# EAGLE design contbrd (EAGLE 9.4.0)

## Sheet 1 of 3: Microcontrollers The STM and ESP
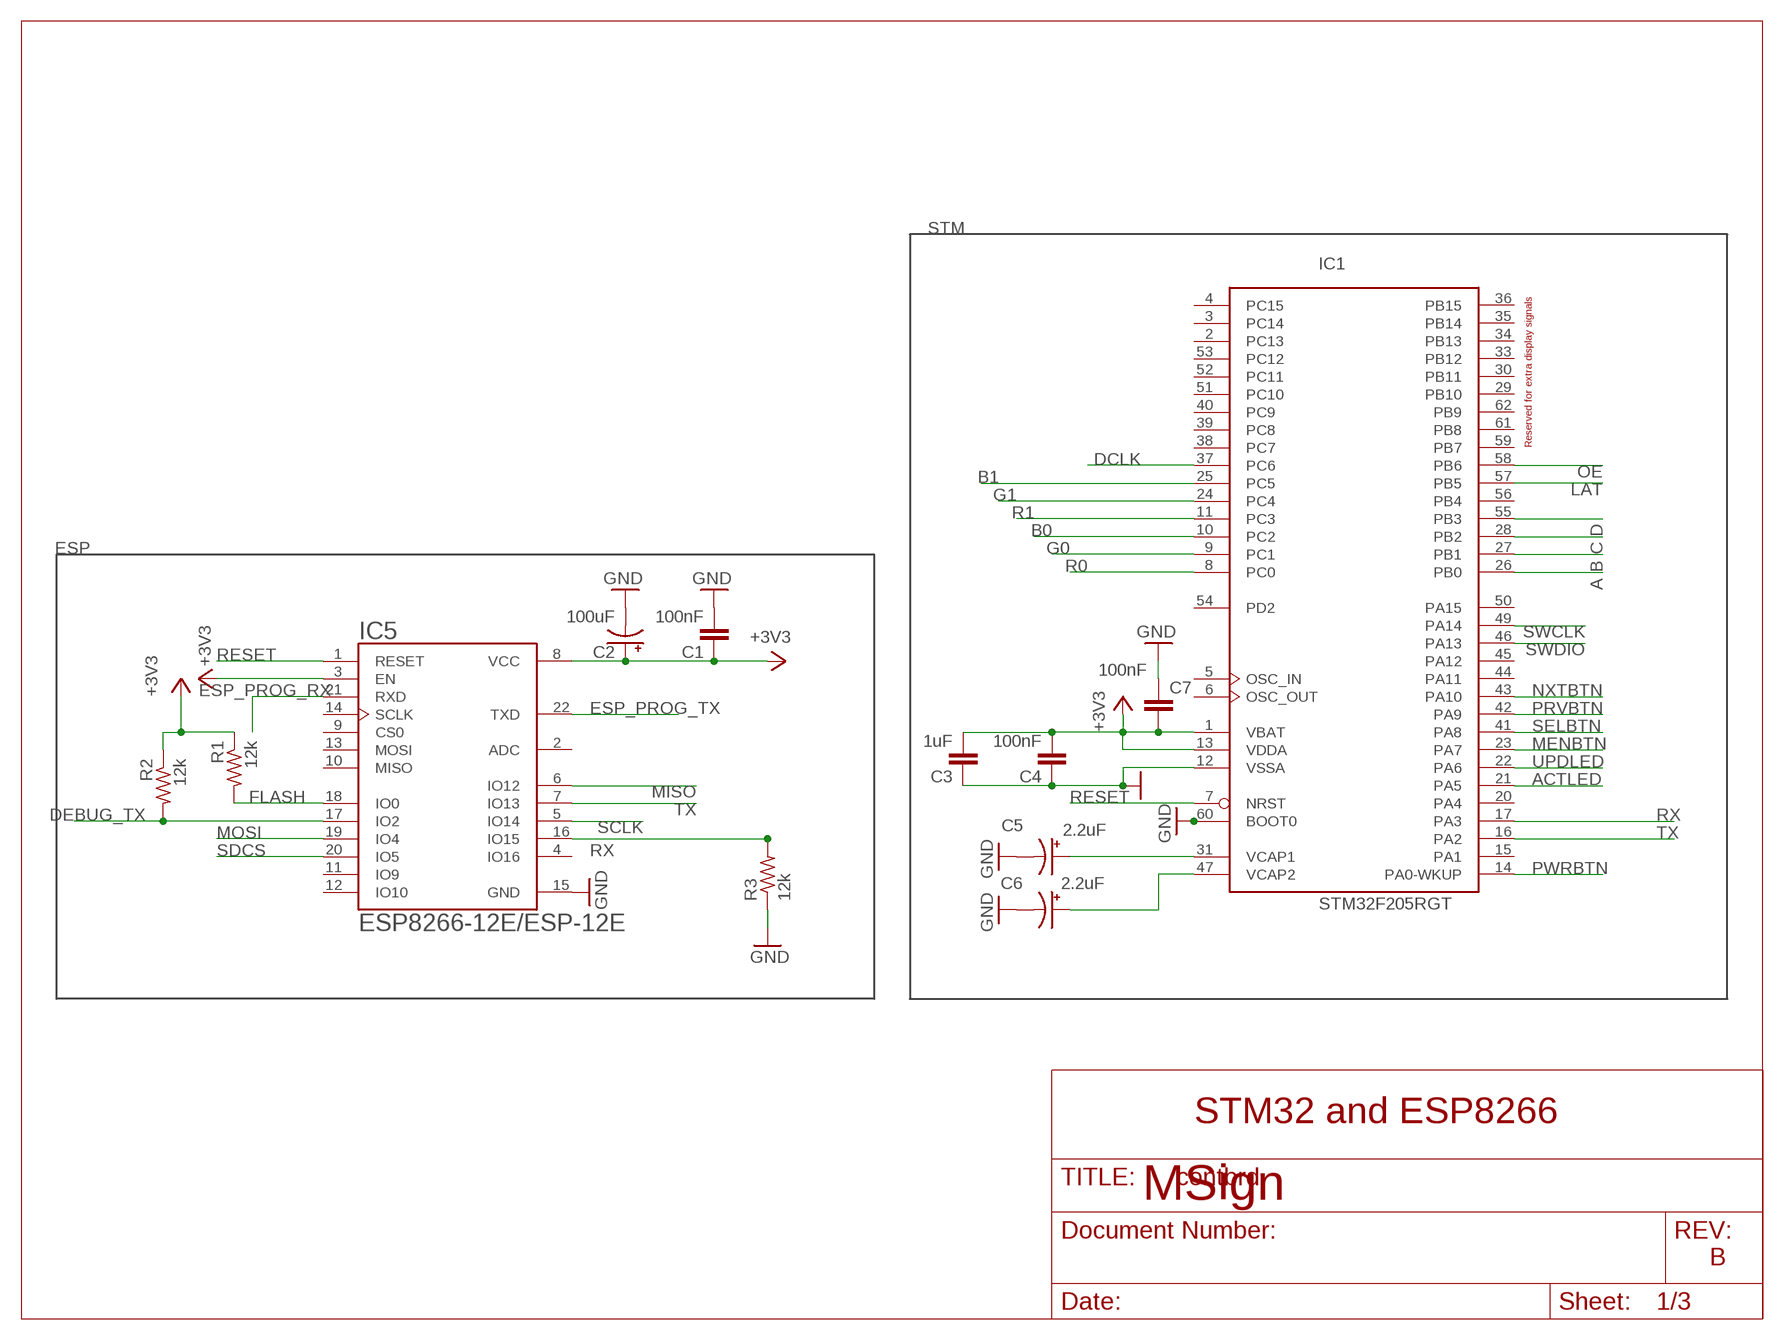
[diagram p0: schematic, sheet 1]

### Parts
C1  100nF  C-EU025-025X050  [C025-025X050]
C2  100uF  CPOL-USE2.5-6  [E2,5-6]
C3  1uF  C-EU050-024X044  [C050-024X044]
C4  100nF  C-EU025-025X050  [C025-025X050]
C5  2.2uF  CPOL-USE1.8-4  [E1,8-4]
C6  2.2uF  CPOL-USE1.8-4  [E1,8-4]
C7  100nF  C-EU025-025X050  [C025-025X050]
IC1  STM32F205RGT  [LQFP64]
IC5  ESP8266-12E/ESP-12E  [XCVR_ESP8266-12E/ESP-12E]
R1  12k  R-US_0204/7  [0204/7]
R2  12k  R-US_0204/7  [0204/7]
R3  12k  R-US_0204/7  [0204/7]

### Nets
+3V3: C1.1 C2.+ C3.2 C4.2 C7.2 IC1.1(VBAT) IC1.13(VDDA) IC5.3(EN) IC5.8(VCC) R1.1 R2.1 ; also sheet 2,3
A: IC1.26(PB0) ; also sheet 3
ACTLED: IC1.21(PA5) ; also sheet 3
B: IC1.27(PB1) ; also sheet 3
B0: IC1.10(PC2) ; also sheet 3
B1: IC1.25(PC5) ; also sheet 3
C: IC1.28(PB2) ; also sheet 3
D: IC1.55(PB3) ; also sheet 3
DCLK: IC1.37(PC6) ; also sheet 3
DEBUG_TX: IC5.17(IO2) R2.2 ; also sheet 3
ESP_PROG_RX: IC5.21(RXD) ; also sheet 3
ESP_PROG_TX: IC5.22(TXD) ; also sheet 3
FLASH: IC5.18(IO0) R1.2 ; also sheet 2
G0: IC1.9(PC1) ; also sheet 3
G1: IC1.24(PC4) ; also sheet 3
GND: C1.2 C2.- C3.1 C4.1 C5.- C6.- C7.1 IC1.12(VSSA) IC1.60(BOOT0) IC5.15(GND) R3.1 ; also sheet 2,3
LAT: IC1.57(PB5) ; also sheet 3
MENBTN: IC1.23(PA7) ; also sheet 3
MISO: IC5.6(IO12) ; also sheet 3
MOSI: IC5.19(IO4) ; also sheet 3
N$2: C5.+ IC1.31(VCAP1)
N$3: C6.+ IC1.47(VCAP2)
NXTBTN: IC1.43(PA10) ; also sheet 3
OE: IC1.58(PB6) ; also sheet 3
PRVBTN: IC1.42(PA9) ; also sheet 3
PWRBTN: IC1.14(PA0-WKUP) ; also sheet 3
R0: IC1.8(PC0) ; also sheet 3
R1: IC1.11(PC3) ; also sheet 3
RESET: IC1.7(NRST) IC5.1(RESET) ; also sheet 2,3
RX: IC1.17(PA3) IC5.16(IO15) R3.2
SCLK: IC5.5(IO14) ; also sheet 3
SDCS: IC5.20(IO5) ; also sheet 3
SELBTN: IC1.41(PA8) ; also sheet 3
SWCLK: IC1.49(PA14) ; also sheet 3
SWDIO: IC1.46(PA13) ; also sheet 3
TX: IC1.16(PA2) IC5.7(IO13)
UPDLED: IC1.22(PA6) ; also sheet 3
Unconnected: IC1.2(PC13) IC1.3(PC14) IC1.4(PC15) IC1.5(OSC_IN) IC1.6(OSC_OUT) IC1.15(PA1) IC1.20(PA4) IC1.29(PB10) IC1.30(PB11) IC1.33(PB12) IC1.34(PB13) IC1.35(PB14) IC1.36(PB15) IC1.38(PC7) IC1.39(PC8) IC1.40(PC9) IC1.44(PA11) IC1.45(PA12) IC1.50(PA15) IC1.51(PC10) IC1.52(PC11) IC1.53(PC12) IC1.54(PD2) IC1.56(PB4) IC1.59(PB7) IC1.61(PB8) IC1.62(PB9) IC5.2(ADC) IC5.4(IO16) IC5.9(CS0) IC5.10(MISO) IC5.11(IO9) IC5.12(IO10) IC5.13(MOSI) IC5.14(SCLK)

### Notes on the sheet
- STM
- Reserved for extra display signals
- ESP
- STM32 and ESP8266
- MSign
- B

## Sheet 2 of 3: Power Regulators and buttons
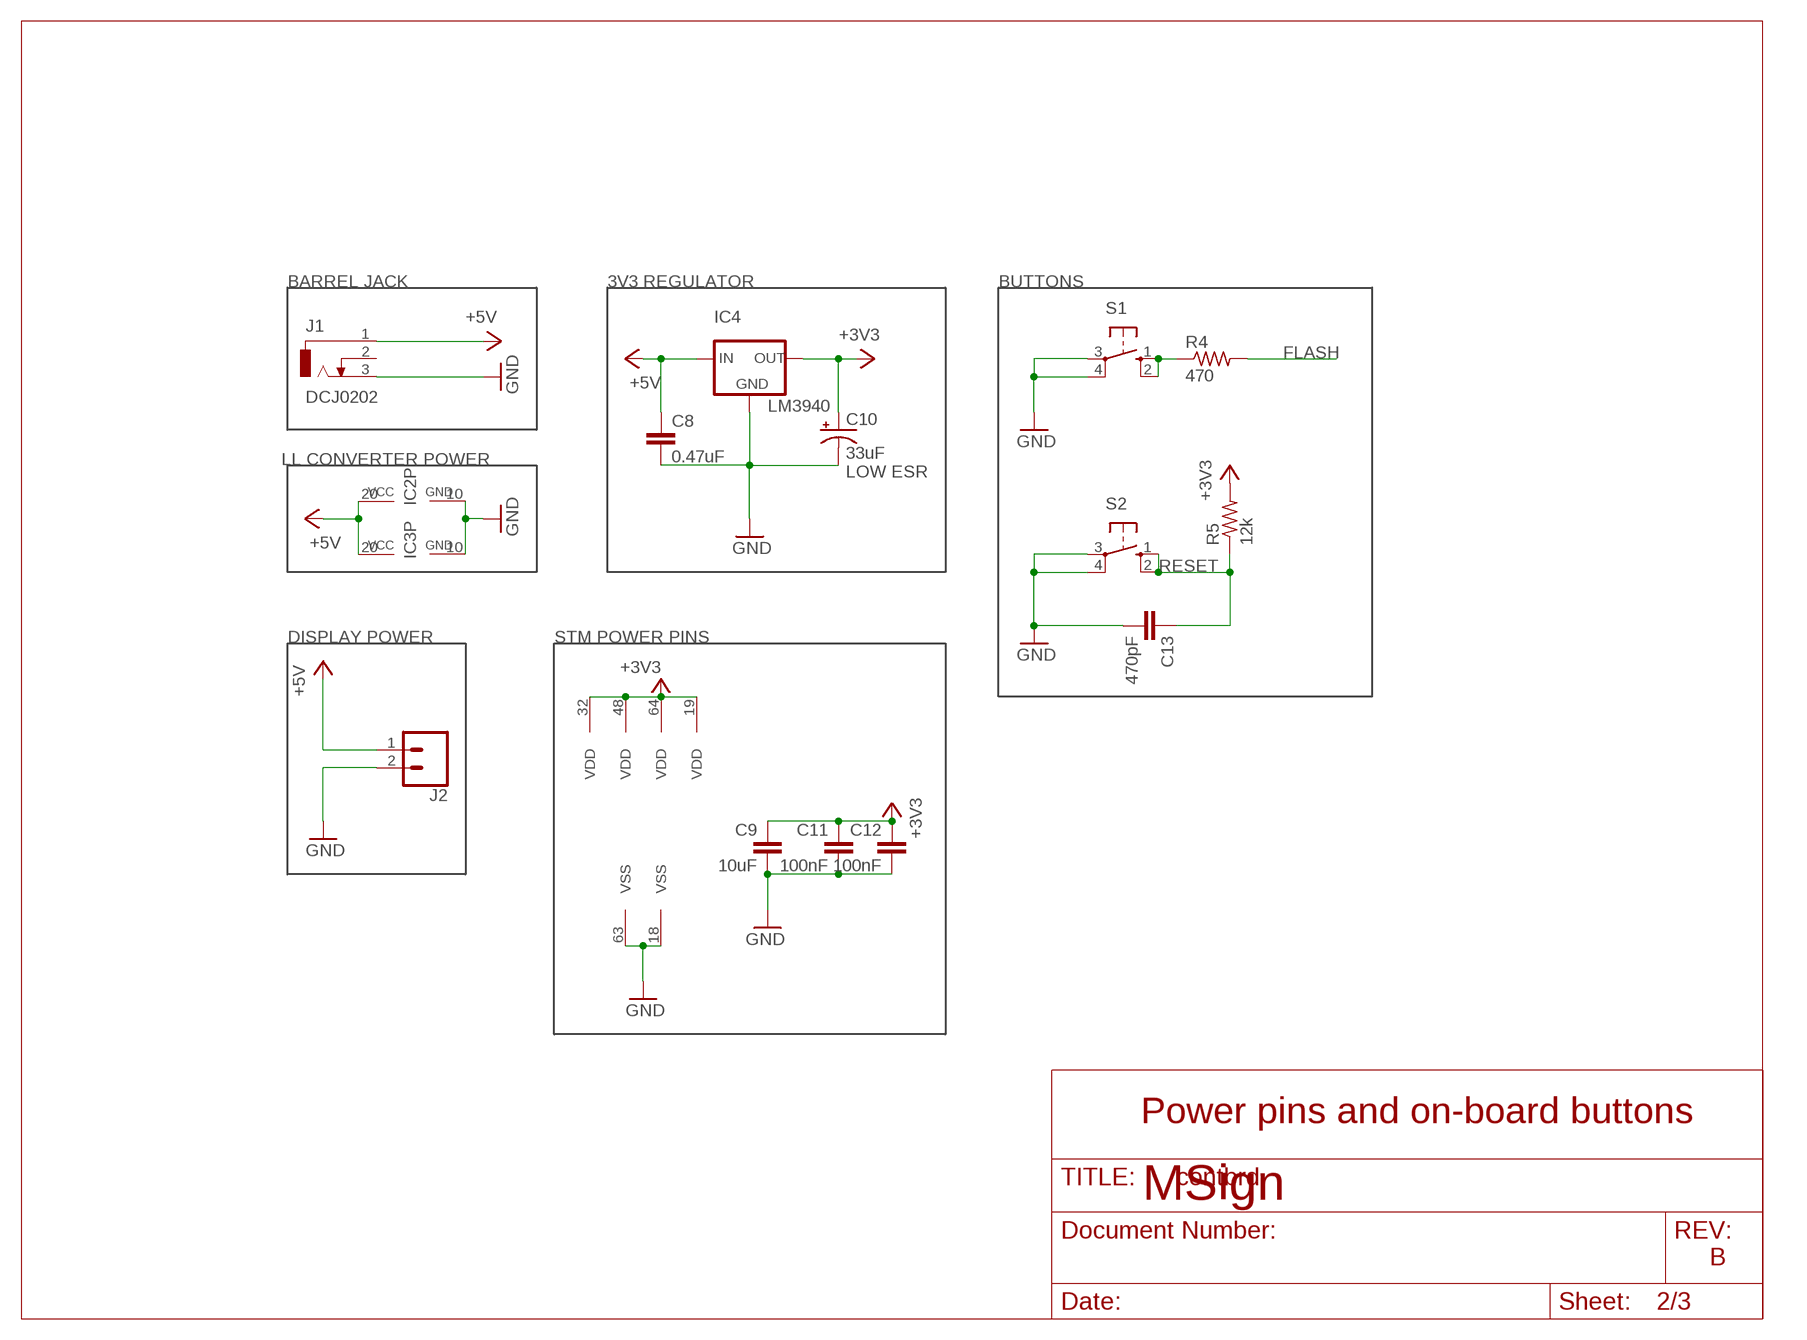
[diagram p1: schematic, sheet 2]

### Parts
C8  0.47uF  C-EU050-024X044  [C050-024X044]
C9  10uF  C-EU025-025X050  [C025-025X050]
C10  33uF  CPOL-USE2-5  [E2-5]
C11  100nF  C-EU025-025X050  [C025-025X050]
C12  100nF  C-EU025-025X050  [C025-025X050]
C13  470pF  C-EU025-025X050  [C025-025X050]
IC2  74HCT244DW  [SO20W]
IC3  74HCT244DW  [SO20W]
IC4  LM3940  [TO220]
J1  DCJ0202  [DCJ0202]
J2  CONN_025MM  [SCREWTERMINAL-5MM-2]
R4  470  R-US_0204/7  [0204/7]
R5  12k  R-US_0204/7  [0204/7]
S1  10-XX  [B3F-10XX]
S2  10-XX  [B3F-10XX]

### Nets
+3V3: C9.1 C10.+ C11.1 C12.1 IC1.19(VDD) IC1.32(VDD) IC1.48(VDD) IC1.64(VDD) IC4.3(OUT) R5.2 ; also sheet 1,3
+5V: C8.1 IC2.20(P:VCC) IC3.20(P:VCC) IC4.1(IN) J1.1 J2.1
FLASH: R4.2 ; also sheet 1
GND: C8.2 C9.2 C10.- C11.2 C12.2 C13.2 IC1.18(VSS) IC1.63(VSS) IC2.10(P:GND) IC3.10(P:GND) IC4.2(GND) J1.3 J2.2 S1.3(P) S1.4(P1) S2.3(P) S2.4(P1) ; also sheet 1,3
N$1: R4.1 S1.1(S) S1.2(S1)
RESET: C13.1 R5.1 S2.1(S) S2.2(S1) ; also sheet 1,3
Unconnected: J1.2

### Notes on the sheet
- BARREL JACK | 3V3 REGULATOR | BUTTONS
- LL CONVERTER POWER
- LOW ESR
- DISPLAY POWER | STM POWER PINS
- Power pins and on-board buttons
- MSign
- B

## Sheet 3 of 3: Connectors External board connectors + debug headers
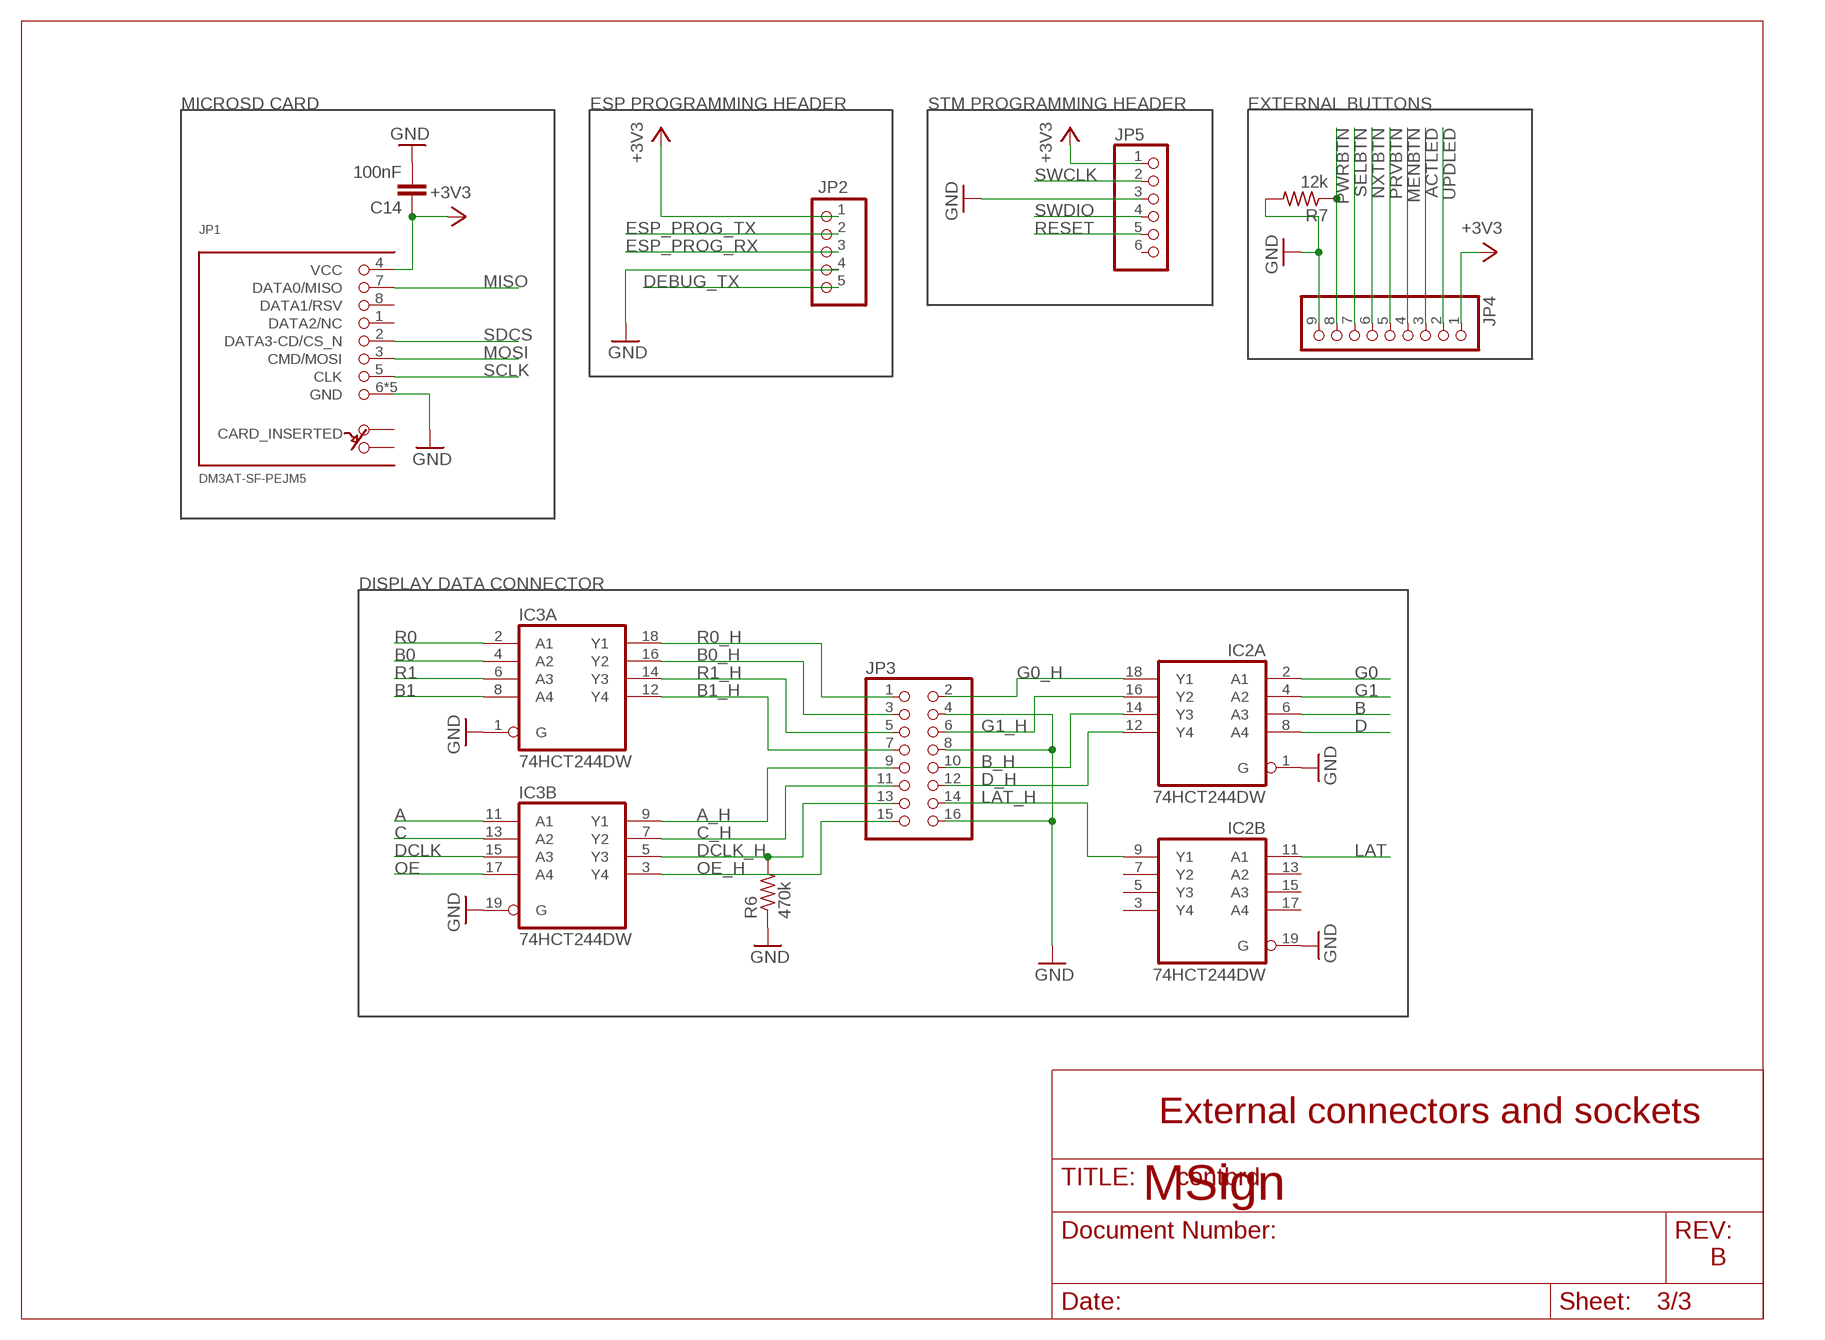
[diagram p2: schematic, sheet 3]

### Parts
C14  100nF  C-EU025-025X050  [C025-025X050]
JP1  DM3AT-SF-PEJM5  [DM3AT-SF-PEJM5]
JP2  PINHD-1X5  [1X05]
JP3  PINHD-2X8  [2X08]
JP4  PINHD-1X9  [1X09]
JP5  PINHD-1X6  [1X06]
R6  470k  R-US_0204/7  [0204/7]
R7  12k  R-US_0204/7  [0204/7]

### Nets
+3V3: C14.1 JP1.4(VCC) JP2.1 JP4.1 JP5.1 ; also sheet 1,2
A: IC3.11(B:A1) ; also sheet 1
A_H: IC3.9(B:Y1) JP3.9
ACTLED: JP4.3 ; also sheet 1
B: IC2.6(A:A3) ; also sheet 1
B0: IC3.4(A:A2) ; also sheet 1
B0_H: IC3.16(A:Y2) JP3.3
B1: IC3.8(A:A4) ; also sheet 1
B1_H: IC3.12(A:Y4) JP3.7
B_H: IC2.14(A:Y3) JP3.10
C: IC3.13(B:A2) ; also sheet 1
C_H: IC3.7(B:Y2) JP3.11
D: IC2.8(A:A4) ; also sheet 1
D_H: IC2.12(A:Y4) JP3.12
DCLK: IC3.15(B:A3) ; also sheet 1
DCLK_H: IC3.5(B:Y3) JP3.13 R6.2
DEBUG_TX: JP2.5 ; also sheet 1
ESP_PROG_RX: JP2.3 ; also sheet 1
ESP_PROG_TX: JP2.2 ; also sheet 1
G0: IC2.2(A:A1) ; also sheet 1
G0_H: IC2.18(A:Y1) JP3.2
G1: IC2.4(A:A2) ; also sheet 1
G1_H: IC2.16(A:Y2) JP3.6
GND: C14.2 IC2.1(A:G) IC2.19(B:G) IC3.1(A:G) IC3.19(B:G) JP1.6(GND) JP1.MOUNT0(GND) JP1.MOUNT1(GND) JP1.MOUNT2(GND) JP1.MOUNT3(GND) JP2.4 JP3.4 JP3.8 JP3.16 JP4.9 JP5.3 R6.1 R7.2 ; also sheet 1,2
LAT: IC2.11(B:A1) ; also sheet 1
LAT_H: IC2.9(B:Y1) JP3.14
MENBTN: JP4.4 ; also sheet 1
MISO: JP1.7(DATA0/MISO) ; also sheet 1
MOSI: JP1.3(CMD/MOSI) ; also sheet 1
NXTBTN: JP4.6 ; also sheet 1
OE: IC3.17(B:A4) ; also sheet 1
OE_H: IC3.3(B:Y4) JP3.15
PRVBTN: JP4.5 ; also sheet 1
PWRBTN: JP4.8 R7.1 ; also sheet 1
R0: IC3.2(A:A1) ; also sheet 1
R0_H: IC3.18(A:Y1) JP3.1
R1: IC3.6(A:A3) ; also sheet 1
R1_H: IC3.14(A:Y3) JP3.5
RESET: JP5.5 ; also sheet 1,2
SCLK: JP1.5(CLK) ; also sheet 1
SDCS: JP1.2(DATA3-CD/CS_N) ; also sheet 1
SELBTN: JP4.7 ; also sheet 1
SWCLK: JP5.2 ; also sheet 1
SWDIO: JP5.4 ; also sheet 1
UPDLED: JP4.2 ; also sheet 1
Unconnected: IC2.3(B:Y4) IC2.5(B:Y3) IC2.7(B:Y2) IC2.13(B:A2) IC2.15(B:A3) IC2.17(B:A4) JP1.1(DATA2/NC) JP1.8(DATA1/RSV) JP1.A JP1.B JP5.6

### Notes on the sheet
- MICROSD CARD | ESP PROGRAMMING HEADER | STM PROGRAMMING HEADER | EXTERNAL BUTTONS
- DISPLAY DATA CONNECTOR
- External connectors and sockets
- MSign
- B

## Library data of the parts
C1 C3 C4 C7-C9 C11-C14 = rcl:C-EU: CAPACITOR, European symbol; SPICEPREFIX: C
C2 C5 C6 C10 = rcl:CPOL-US: POLARIZED CAPACITOR, American symbol; SPICEPREFIX: C
IC1 = micro-stm_v3:STM32F205R*T: ARM 32-bit Cortex™-M3 CPU 120 MHz maximum frequency 128 to 1024 Kbytes of Flash memory 64 to 128 kbytes of SRAM 51 GPIOs 1.8 to 3.6 V application supply
IC2 IC3 = 74xx-eu:74*244: Octal BUFFER and LINE DRIVER, 3-state
IC4 = LM3940:LM3940: LM3940 1A Low Dropout Regulator for 5V to 3.3V Conversion; AVAILABILITY: Unavailable; MF: Texas Instruments; MP: LM3940; PACKAGE: SOT-223-4 Texas Instruments; PRICE: None
IC5 = ESP8266-12E_ESP-12E:ESP8266-12E/ESP-12E: ESP-12E WiFi Module; AVAILABILITY: Unavailable; DESCRIPTION: This WiFi module has a 32-bit MCU micro and clock speeds supporting 80 MHz or 160 MHz. Supports the RTOS and integrated Wi-Fi MAC/BB/RF/PA/LNA, and has an on-board antenna.; MF: AI-Thinker; MP: ESP8266-12E/ESP-12E; PACKAGE: None; PRICE: None
J1 = con-jack:DCJ0202: DC POWER JACK Source: DCJ0202.pdf; OC_FARNELL: unknown; OC_NEWARK: unknown
J2 = SparkFun-Connectors:CONN_02: Multi connection point. Often used as Generic Header-pin footprint for 0.1 inch spaced/style header connections On any of the 0.1 inch spaced packages, you can populate with these: Break Away Headers - Straight <https://www.sparkfun.com/products/116> (PRT-00116) Break Away Male Headers - Right Angle <https://www.sparkfun.com/products/553> (PRT-00553) Female Headers <https://www.sparkfun.com/products/115> (PRT-00115) Break Away Headers - Machine Pin <https://www.sparkfun.com/products/117> (PRT-00117) Break Away Female Headers - Swiss Machine Pin <https://www.sparkfun.com/products/743> (PRT-00743) For SCREWTERMINALS and SPRING TERMINALS visit here: Screw Terimnals on SparkFun.com <https://www.sparkfun.com/search/results?term=Screw+Terminals> (5mm/3.5mm/2.54mm spacing) This device is also useful as a general connection point to wire up your design to another part of your project. Our various solder wires solder well into these plated through hole pads. Hook-Up Wire - Assortment (Stranded, 22 AWG) <https://www.sparkfun.com/products/11375> (PRT-11375) Hook-Up Wire - Assortment (Solid Core, 22 AWG) <https://www.sparkfun.com/products/11367> (PRT-11367) View the entire wire category on our website here <https://www.sparkfun.com/categories/141> Special notes: Molex polarized connector foot print use with: PRT-08233 with associated crimp pins and housings. 2.54_SCREWTERM for use with PRT-10571. 3.5mm Screw Terminal footprints for PRT-08084 5mm Screw Terminal footprints for use with PRT-08432; SF_SKU: PRT-08432
JP1 = connector:DM3AT-SF-PEJM5: CONN MICRO SD R/A PUSH-PUSH SMD; DESCRIPTION: CONN MICRO SD CARD PUSH-PUSH R/A; DIGIKEY: HR1964CT-ND; MANUFACTURER: Hirose Electric Co Ltd; MPN: DM3AT-SF-PEJM5
JP2 = pinhead:PINHD-1X5: PIN HEADER
JP3 = pinhead:PINHD-2X8: PIN HEADER
JP4 = pinhead:PINHD-1X9: PIN HEADER
JP5 = pinhead:PINHD-1X6: PIN HEADER
R1-R7 = rcl:R-US_: RESISTOR, American symbol; SPICEPREFIX: R
S1 S2 = switch-omron:10-XX: OMRON SWITCH; MPN: B3F-1000; OC_FARNELL: 176432; OC_NEWARK: 36M3542

## Board
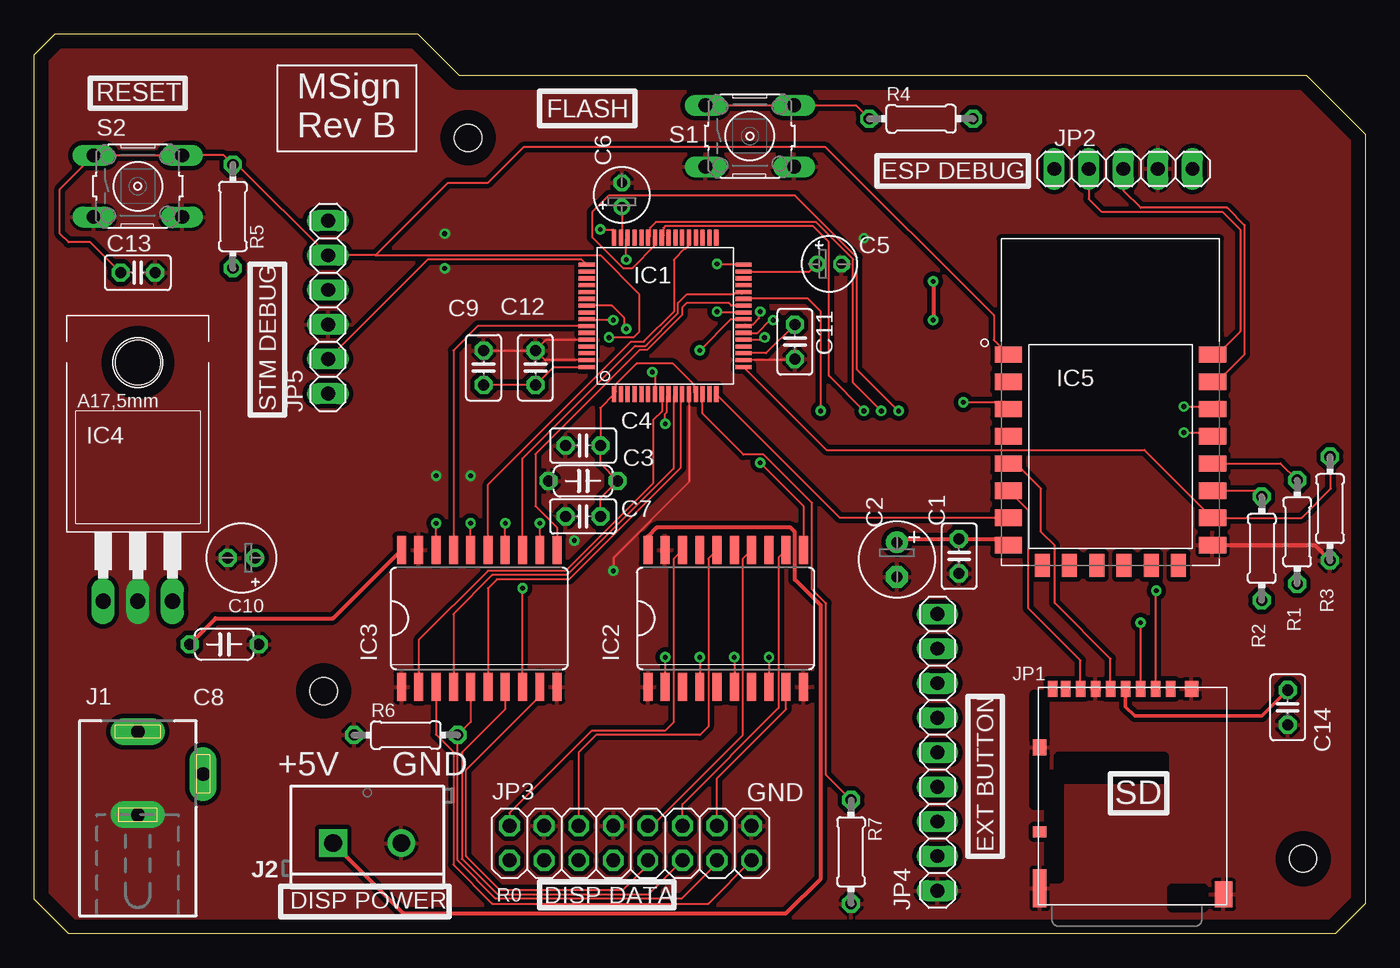
[diagram p3: board, top side]
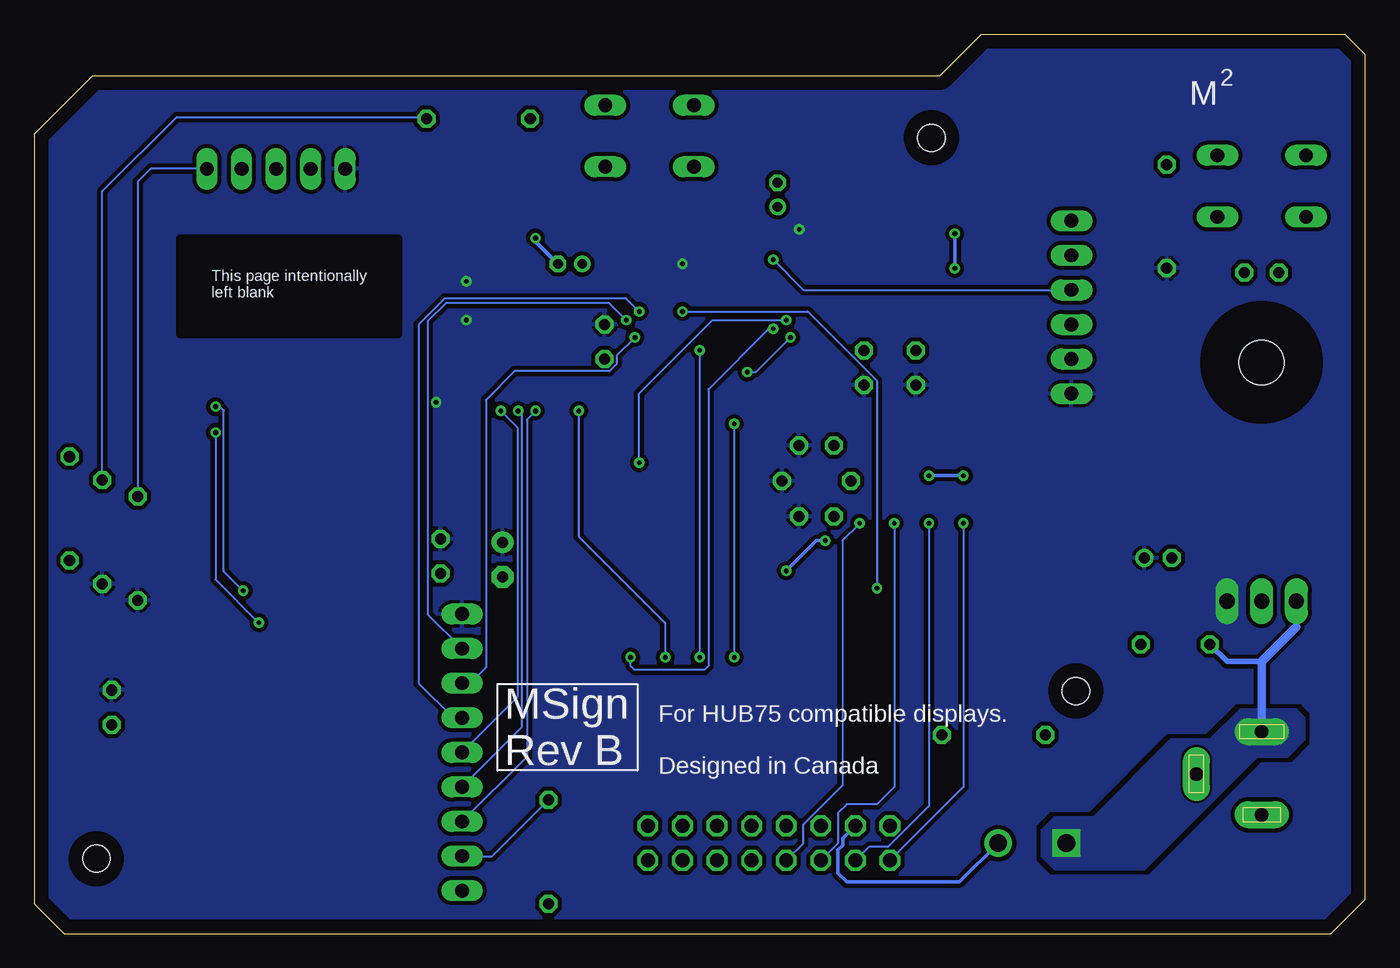
[diagram p4: board, bottom side, seen from below]

Size 97.79 x 66.1 mm. Coordinates in mm from the lower left corner, seen from the top.
Outline: 97.79,58.74 93.47,63.06 31.24,63.06 28.19,66.1 1.52,66.1 0,64.58 0,2.54 2.54,0 95.57,0 97.79,2.22 97.79,58.74
Copper layers (1*16): Top 0.035mm / dielectric 1.5mm / Bottom 0.035mm
Design rules "default": minimum track width 6mil, minimum drill 0.35mm, track to track 6mil, track to pad 6mil, pad to pad 6mil, via to via 6mil, smd to smd 6mil, copper to edge 40mil, drill to drill 6mil, minimum pad ring 10mil, minimum via ring 8mil, stop-mask expansion 4mil, vias tented up to drill 0mil, thermal gap 10mil
Holes 2 mm at 31.88,58.48 21.27,17.84 93.22,5.52

### Footprints (pad centres in the part's own frame; a part is rotated, then mirrored left to right if it is on the bottom)
C025-025X050 = drill 0.813 octagon: 1 -1.27,0; 2 1.27,0
E2,5-6 = drill 0.813 pad 1.6: + -1.27,0 | drill 0.813 pad 1.6 octagon: - 1.27,0
C050-024X044 = drill 0.813 octagon: 1 -2.54,0; 2 2.54,0
E1,8-4 = drill 0.711 pad 1.168: + -0.889,0 | drill 0.711 pad 1.168 octagon: - 0.889,0
E2-5 = drill 0.813 pad 1.27: + -1.016,0 | drill 0.813 pad 1.27 octagon: - 1.016,0
LQFP64 = smd 0.3 x 1.2: 1 -3.75,-5.75; 2 -3.25,-5.75; 3 -2.75,-5.75; 4 -2.25,-5.75; 5 -1.75,-5.75; 6 -1.25,-5.75; 7 -0.75,-5.75; 8 -0.25,-5.75; 9 0.25,-5.75; 10 0.75,-5.75; 11 1.25,-5.75; 12 1.75,-5.75; 13 2.25,-5.75; 14 2.75,-5.75; 15 3.25,-5.75; 16 3.75,-5.75; 33 3.75,5.75; 34 3.25,5.75; 35 2.75,5.75; 36 2.25,5.75; 37 1.75,5.75; 38 1.25,5.75; 39 0.75,5.75; 40 0.25,5.75; 41 -0.25,5.75; 42 -0.75,5.75; 43 -1.25,5.75; 44 -1.75,5.75; 45 -2.25,5.75; 46 -2.75,5.75; 47 -3.25,5.75; 48 -3.75,5.75 | smd 1.2 x 0.3: 17 5.75,-3.75; 18 5.75,-3.25; 19 5.75,-2.75; 20 5.75,-2.25; 21 5.75,-1.75; 22 5.75,-1.25; 23 5.75,-0.75; 24 5.75,-0.25; 25 5.75,0.25; 26 5.75,0.75; 27 5.75,1.25; 28 5.75,1.75; 29 5.75,2.25; 30 5.75,2.75; 31 5.75,3.25; 32 5.75,3.75; 49 -5.75,3.75; 50 -5.75,3.25; 51 -5.75,2.75; 52 -5.75,2.25; 53 -5.75,1.75; 54 -5.75,1.25; 55 -5.75,0.75; 56 -5.75,0.25; 57 -5.75,-0.25; 58 -5.75,-0.75; 59 -5.75,-1.25; 60 -5.75,-1.75; 61 -5.75,-2.25; 62 -5.75,-2.75; 63 -5.75,-3.25; 64 -5.75,-3.75
SO20W = smd 0.66 x 2.032: 1 -5.715,-5.029; 2 -4.445,-5.029; 3 -3.175,-5.029; 4 -1.905,-5.029; 5 -0.635,-5.029; 6 0.635,-5.029; 7 1.905,-5.029; 8 3.175,-5.029; 9 4.445,-5.029; 10 5.715,-5.029; 11 5.715,5.029; 12 4.445,5.029; 13 3.175,5.029; 14 1.905,5.029; 15 0.635,5.029; 16 -0.635,5.029; 17 -1.905,5.029; 18 -3.175,5.029; 19 -4.445,5.029; 20 -5.715,5.029
TO220 = drill 1.118 long: 1 -2.54,-10.16; 2 0,-10.16; 3 2.54,-10.16 | hole 3.302: 0,7.366
XCVR_ESP8266-12E/ESP-12E = smd 2 x 1.2: 1 -7.5,7; 2 -7.5,5; 3 -7.5,3; 4 -7.5,1; 5 -7.5,-1; 6 -7.5,-3; 7 -7.5,-5; 8 -7.5,-7; 15 7.5,-7; 16 7.5,-5; 17 7.5,-3; 18 7.5,-1; 19 7.5,1; 20 7.5,3; 21 7.5,5; 22 7.5,7 | smd 1.1 x 1.7: 9 -5,-8.5; 10 -3,-8.5; 11 -1,-8.5; 12 1,-8.5; 13 3,-8.5; 14 5,-8.5
DCJ0202 = drill 1 pad 2 long: 1 0,3.1; 2 4.8,0; 3 0,-3
SCREWTERMINAL-5MM-2 = drill 1.3 pad 2.032 square: 1 0,0 | drill 1.3 pad 2.032: 2 5,0
DM3AT-SF-PEJM5 = smd 0.7 x 1.2: 1 3.2,-0.1; 2 2.1,-0.1; 3 1,-0.1; 4 -0.1,-0.1; 5 -1.2,-0.1; 6 -2.3,-0.1; 7 -3.4,-0.1; 8 -4.5,-0.1; B -5.45,-0.1 | smd 1 x 0.8: A -6.4,-10.6 | smd 1 x 1.2: MOUNT0 4.75,-0.1; MOUNT1 -6.4,-4.4 | smd 1 x 2.8: MOUNT2 -6.4,-14.75 | smd 1.3 x 1.9: MOUNT3 7.1,-15.2
1X05 = drill 1.016 long: 1 -5.08,0; 2 -2.54,0; 3 0,0; 4 2.54,0; 5 5.08,0
2X08 = drill 1.016 octagon: 1 -8.89,-1.27; 2 -8.89,1.27; 3 -6.35,-1.27; 4 -6.35,1.27; 5 -3.81,-1.27; 6 -3.81,1.27; 7 -1.27,-1.27; 8 -1.27,1.27; 9 1.27,-1.27; 10 1.27,1.27; 11 3.81,-1.27; 12 3.81,1.27; 13 6.35,-1.27; 14 6.35,1.27; 15 8.89,-1.27; 16 8.89,1.27
1X09 = drill 1.016 long: 1 -10.16,0; 2 -7.62,0; 3 -5.08,0; 4 -2.54,0; 5 0,0; 6 2.54,0; 7 5.08,0; 8 7.62,0; 9 10.16,0
1X06 = drill 1.016 long: 1 -6.35,0; 2 -3.81,0; 3 -1.27,0; 4 1.27,0; 5 3.81,0; 6 6.35,0
0204/7 = drill 0.813 octagon: 1 -3.81,0; 2 3.81,0
B3F-10XX = drill 1.016 long: 1 -3.251,2.261; 2 3.251,2.261; 3 -3.251,-2.261; 4 3.251,-2.261

### Placement (x,y rotation side)
C1  67.94,27.75 270 top
C2  63.37,27.5 270 top
C3  40.32,33.27 0 top
C4  40.32,35.88 0 top
C5  58.42,49.21 0 top
C6  43.18,54.29 90 top
C7  40.32,30.67 0 top
C8  13.97,21.27 0 top
C9  33.02,41.59 90 top
C10  15.24,27.62 180 top
C11  55.88,43.5 270 top
C12  36.83,41.59 90 top
C13  7.62,48.58 0 top
C14  92.08,16.64 270 top
IC1  46.35,45.4 0 top
IC2  50.8,23.18 0 top
IC3  32.7,23.18 0 top
IC4  7.62,34.61 0 top
IC5  79.06,35.56 0 top
J1  7.62,11.75 0 top
J2  21.97,6.67 0 top
JP1  80.26,18.1 0 top
JP2  80.01,56.2 0 top
JP3  43.81,6.67 0 top
JP4  66.36,13.34 270 top
JP5  21.59,46.04 90 top
R1  92.77,29.53 90 top
R2  90.17,28.32 90 top
R3  95.19,31.24 90 top
R4  65.15,59.88 0 top
R5  14.61,52.71 270 top
R6  27.3,14.61 0 top
R7  60.01,6.03 270 top
S1  52.58,58.61 0 top
S2  7.62,54.93 0 top

### Tracks (layer width: path | path; a pad name or v marks a point on that pad's centre or on a via)
+3V3  (via drill 0.35)
  Top 0.152: C11.1 53.77,42.65 IC1.19 | IC1.64 38.16,41.65 C12.1 C9.1 | v50.16,49.21 52.05,49.21 IC1.32 | v41.59,51.75 42.55,51.75 42.6,51.69 IC1.48 | IC1.13 48.48,39.77 48.48,40.35 46.95,41.88 44.26,41.88 42.73,40.35 42.73,39.77 IC1.1 41.59,38.64 C4.2 41.59,34.54 C3.2 41.59,32 C7.2 | v68.26,39.05 71.06,39.05 IC5.3
  Top 0.254: C14.1 90.17,16 80.83,16 80.16,16.67 JP1.4
  Top 0.305: v66.04,47.94 v66.04,45.08 | C2.+ 63.63,29.02 C1.1 71.1,29.02 IC5.8
  pour Bottom (isolate 0.305, rank 6): -0.13,66.23 97.79,66.23 97.79,0.32 -0.13,0.32
  pour Bottom (no thermals): 8.89,26.35 8.89,22.54 11.43,22.54 11.43,26.35
+5V
  Top 0.305: C8.1 13.34,23.18 21.96,23.18 IC3.20 | J2.1 27.11,1.52 55.24,1.52 57.78,4.06 57.78,24.13 55.88,26.04 55.88,29.53 55.56,29.84 45.72,29.84 45.09,29.21 IC2.20
  Bottom 0.406: 5.08,22.54 IC4.1 | C8.1 10.16,20 7.62,20
  Bottom 0.61: J1.1 7.62,20 5.08,22.54
  pour Bottom (no thermals): 5.08,16.51 9.21,16.51 11.43,14.29 14.29,14.29 20,8.57 22.86,8.57 23.81,7.62 23.81,5.71 22.86,4.76 16.19,4.76 7.94,13.02 5.71,13.02 4.45,14.29 4.45,15.88
A
  Top 0.152: IC1.26 51.23,46.15 51.05,46.33 47.91,46.33 47.6,46.01 47.6,45.47 45.02,42.89 44.48,42.89 36.83,35.24 36.83,31.43 38.42,29.84 IC3.11
A_H
  Top 0.152: JP3.9 45.09,5.08 43.22,3.22 34.25,3.22 31.75,5.71 31.75,12.07 37.15,17.46 IC3.9
ACTLED  (via drill 0.35)
  Top 0.152: IC1.21 53.49,43.65 v53.66,43.82
  Bottom 0.152: v53.66,43.82 54.99,42.48 54.99,41.86 55.51,41.34 62.48,41.34 64.61,39.22 64.61,19.59 65.78,18.42 JP4.3
B  (via drill 0.35)
  Top 0.152: v57.78,38.42 57.78,45.72 56.85,46.65 IC1.27 | v51.44,20.32 IC2.6
  Bottom 0.152: v57.78,38.42 57.78,29.21 51.44,22.86 v51.44,20.32
B0
  Top 0.152: IC1.10 46.98,39.53 46.98,34.17 39.17,26.35 33.66,26.35 30.8,23.49 IC3.4
B0_H  (via drill 0.35)
  Top 0.152: IC3.16 v32.07,30.16
  Bottom 0.152: v32.07,30.16 32.07,9.39 35.07,6.39 36.47,6.39 JP3.3
B1  (via drill 0.35)
  Top 0.152: IC1.25 50.23,45.65 v50.16,45.72 | IC3.8 v35.88,25.4
  Bottom 0.152: v35.88,25.4 35.88,40.64 40.96,45.72 v50.16,45.72
B1_H  (via drill 0.35)
  Top 0.152: v37.15,30.16 IC3.12
  Bottom 0.152: v37.15,30.16 38.42,28.89 38.42,10.93 41.31,8.03 41.31,6.63 JP3.7
B_H
  Top 0.152: JP3.10 45.4,7.94 52.07,14.6 52.07,27.57 IC2.14
C
  Top 0.152: IC1.28 51.98,47.03 51.41,47.03 51.37,46.99 47.94,46.99 47.3,46.34 47.3,45.59 44.89,43.19 44.15,43.19 35.88,34.93 IC3.13
C_H
  Top 0.152: IC3.7 34.61,16.51 31.43,13.34 31.43,5.51 34.03,2.91 45.14,2.91 JP3.11
D  (via drill 0.35)
  Top 0.152: v43.5,44.45 43.34,44.61 43.34,45.26 42.45,46.15 IC1.55 | v53.98,20.32 IC2.8
  Bottom 0.152: v43.5,44.45 43.81,44.45 48.26,40.01 48.26,19.68 48.55,19.4 53.69,19.4 53.98,19.68 v53.98,20.32
D_H
  Top 0.152: JP3.12 47.62,9.52 54.69,16.59 54.69,27.65 IC2.12
DCLK
  Top 0.152: IC3.15 33.36,28.23 33.36,33.02 43.84,43.5 44.77,43.5 46.99,45.72 46.99,49.53 47.78,50.32 47.85,50.32 48.1,50.58 IC1.37
DCLK_H
  Top 0.152: JP3.13 50.16,5.19 47.57,2.6 33.92,2.6 31.11,5.4 R6.2 32.07,15.56 IC3.5
DEBUG_TX
  Top 0.152: IC5.17 89.74,32.56 R2.2
  Bottom 0.152: JP2.5 89.22,56.2 90.17,55.25 R2.2
ESP_PROG_RX
  Top 0.152: JP2.3 80.01,54.61 81.28,53.34 87.63,53.34 88.9,52.07 88.9,42.57 86.89,40.56 IC5.21
ESP_PROG_TX
  Top 0.152: JP2.2 77.47,53.97 78.42,53.02 87.31,53.02 88.58,51.75 88.58,44.25 86.89,42.56 IC5.22
FLASH
  Top 0.152: IC5.18 91.55,34.56 R1.2
  Bottom 0.152: R1.2 92.77,54.55 87.31,60.01 69.09,60.01 R4.2
G0  (via drill 0.35)
  Top 0.152: v46.35,20.32 IC2.2 | v46.35,37.47 46.35,38.2 46.48,38.33 46.48,39.53 IC1.9
  Bottom 0.152: v46.35,20.32 v46.35,37.47
G0_H
  Top 0.152: IC2.18 46.99,27.57 46.99,15.56 46.35,14.92 40.96,14.92 34.92,8.89 JP3.2
G1  (via drill 0.35)
  Top 0.152: v48.9,20.32 IC2.4 | v48.9,42.86 51.19,45.15 IC1.24
  Bottom 0.152: v48.9,20.32 v48.9,42.86
G1_H
  Top 0.152: IC2.16 49.53,27.57 49.53,15.24 48.9,14.6 41.27,14.6 40.01,13.34 JP3.6
GND  (via drill 0.35)
  Top 0.152: C11.2 55.8,42.15 IC1.18 | IC1.63 37.54,42.15 C12.2 | C12.2 37.62,43.65 IC1.60 | C9.2 C12.2 | IC1.12 48.1,33.18 42.55,27.62 v42.55,26.67
  Top 0.305: IC5.15 94.06,28.56 R3.1
  Bottom 0.254: v42.55,26.67 40.32,28.89 v39.69,28.89 | JP3.4 38.38,7.02 38.38,6.52 38.73,6.16 38.73,4.45 38.1,3.81 29.83,3.81 J2.2 | v29.53,33.65 v32.07,33.65 | v30.16,51.43 v30.16,48.9
  Bottom 0.305: C5.- 60.96,50.86 v60.96,51.12
  pour Top (isolate 0.33, rank 6): 0,66.23 97.79,66.23 97.79,0.32 0,0.32
  pour Top (no thermals): 6.35,26.35 6.35,22.54 8.89,22.54 8.89,26.35
  pour Top (no thermals): 5.08,10.48 9.84,10.48 9.84,7.3 9.84,6.99 5.08,6.99
LAT  (via drill 0.35)
  Top 0.152: v53.34,34.61 56.52,31.43 IC2.11 | v42.55,45.08 40.67,45.08 IC1.57
  Bottom 0.152: v53.34,34.61 53.34,39.69 47.94,45.08 v42.55,45.08
LAT_H
  Top 0.152: JP3.14 50.16,11.43 55.24,16.51 IC2.9
MENBTN  (via drill 0.35)
  Top 0.152: v53.34,45.72 53.25,45.72 53.25,45.23 52.8,44.77 52.23,44.77 IC1.23
  Bottom 0.152: v53.34,45.72 54.29,46.67 67.63,46.67 69.53,44.77 69.53,18.42 66.99,15.87 JP4.4
MISO
  Top 0.152: JP1.7 76.86,20.08 73.03,23.91 73.03,31.09 IC5.6
MOSI  (via drill 0.35)
  Top 0.152: v81.28,22.86 81.26,22.84 JP1.3 | v84.45,36.83 86.29,36.83 IC5.19
  Bottom 0.152: v84.45,36.83 84.45,26.04 v81.28,22.86
N$1
  Top 0.152: R4.1 60.35,60.87 55.88,60.87 S1.2 S1.1
N$2
  Top 0.152: IC1.31 56.97,48.65 C5.+
N$3
  Top 0.152: C6.+ 43.18,51.23 IC1.47
NXTBTN  (via drill 0.35)
  Top 0.152: IC1.43 45.23,51.27 45.23,51.85 45.66,52.29 57.42,52.29 60.15,49.56 60.15,40.5 v62.23,38.42
  Bottom 0.152: v62.23,38.42 61.98,38.16 61.98,15.18 JP4.6
OE
  Top 0.152: IC1.58 32.59,44.65 30.8,42.86 IC3.17
OE_H
  Top 0.152: IC3.3 29.53,14.66 30.8,13.39 30.8,5.08 33.66,2.22 49.53,2.22 JP3.15
PRVBTN  (via drill 0.35)
  Top 0.152: v63.5,38.42 60.45,41.47 60.45,49.69 55.9,54.24 42.2,54.24 40.99,53.03 40.99,51.18 43.25,48.92 43.95,48.92 45.6,50.58 IC1.42
  Bottom 0.152: v63.5,38.42 62.28,37.2 62.28,17.41 JP4.5
PWRBTN
  Top 0.152: R7.1 58.17,11.68 58.17,24.29 57.15,25.3 57.15,31.66 53.59,35.21 52.1,35.21 49.1,38.21 IC1.14
  Bottom 0.152: JP4.8 64.14,5.71 R7.1
R0
  Top 0.152: IC1.8 46.1,38.38 45.47,37.75 45.47,33.09 39.05,26.67 33.34,26.67 28.26,21.59 IC3.2
R0_H  (via drill 0.35)
  Top 0.152: IC3.18 v29.53,30.16
  Bottom 0.152: v29.53,30.16 29.53,10.79 JP3.1
R1
  Top 0.152: IC1.11 47.48,39.53 47.48,34.24 39.29,26.05 34,26.05 33.34,25.38 IC3.6
R1_H  (via drill 0.35)
  Top 0.152: IC3.14 v34.61,30.16
  Bottom 0.152: v34.61,30.16 34.61,10.79 35.88,9.52 38.1,9.52 38.73,8.89 38.73,6.67 JP3.5
RESET  (via drill 0.35)
  Top 0.152: C13.1 4.13,50.8 2.54,50.8 1.91,51.43 1.91,54.72 S2.1 S2.2 13.93,57.19 R5.1 14.92,56.51 JP5.5 25.08,49.85 | v45.4,41.28 45.6,41.07 IC1.7 | 25.08,49.85 41.59,49.85 44.45,46.99 44.45,44.23 44.04,43.82 v42.23,43.82 | 25.08,49.85 30.39,55.16 33.31,55.16 35.94,57.79 58.15,57.79 70.48,45.44 70.48,43.62 71.55,42.56 IC5.1
  Bottom 0.152: v45.4,41.28 44.77,41.28 v42.23,43.82
RX
  Top 0.152: IC1.17 58.2,35.56 81.56,35.56 IC5.16 93.11,30.56 95.25,32.7 95.25,34.99 R3.2
SCLK
  Top 0.152: JP1.5 79.06,20.22 74.97,24.31 74.97,28.53 73.97,29.54 73.97,32.7 72.11,34.56 IC5.5
SDCS  (via drill 0.35)
  Top 0.152: v82.42,25.21 82.36,25.15 JP1.2 | IC5.20 86.38,38.73 v84.45,38.73
  Bottom 0.152: v84.45,38.73 84.14,38.73 83.85,38.45 83.85,26.63 v82.42,25.21
SELBTN  (via drill 0.35)
  Top 0.152: IC1.41 46.23,51.27 46.23,51.85 46.36,51.98 57.22,51.98 58.37,50.83 58.37,41.01 v60.96,38.42
  Bottom 0.152: v60.96,38.42 61.59,37.78 61.59,13.02 JP4.7
SWCLK
  Top 0.152: IC1.49 40.23,49.53 28.89,49.53 JP5.2
SWDIO  (via drill 0.35)
  Top 0.152: v43.5,49.53 43.5,51.04 IC1.46
  Bottom 0.152: v43.5,49.53 41.27,47.31 JP5.4
TX
  Top 0.152: IC1.16 58.69,31.07 58.77,30.99 59.2,30.56 IC5.7
UPDLED  (via drill 0.35)
  Top 0.152: IC1.22 53.14,44.15 54.07,45.08 v54.29,45.08
  Bottom 0.152: v54.29,45.08 55.56,46.36 67.51,46.36 68.87,45 68.87,23.47 JP4.2

### Text on the board
tPlace: RESET | FLASH | MSign / Rev B | ESP DEBUG | STM DEBUG | +5V | GND | GND | SD | EXT BUTTON | DISP POWER | R0 | DISP DATA
bPlace: 2 | M | This page intentionally / left blank | MSign / Rev B | For HUB75 compatible displays. / / Designed in Canada
Notes: Mounting holes M2 | White soldermask PCB | 1.6mm thick